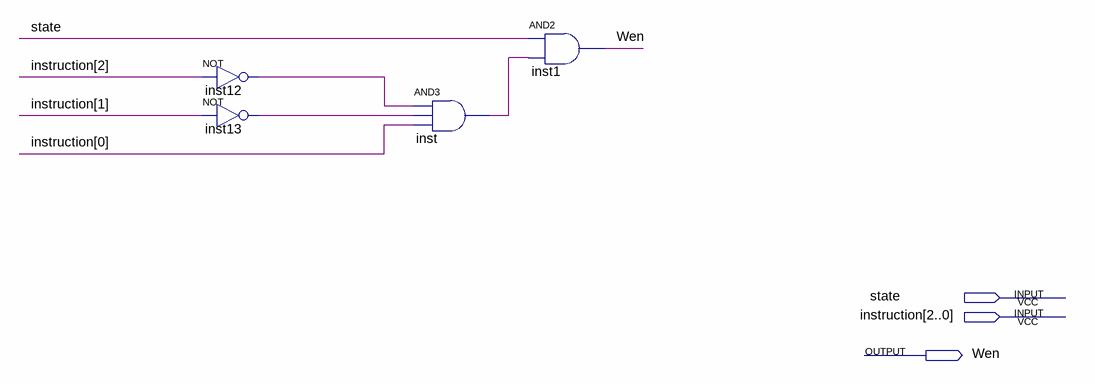
[diagram p0: schematic sheet]
// Quartus schematic controler_write_enable.bdf as structural Verilog: 4 symbols, 3 pins
module controler_write_enable (
  input  state,
  input  [2:0] instruction,
  output Wen
);

  wire inst12_out, inst13_out, inst_out;

  not inst12 (inst12_out, instruction[2]);
  not inst13 (inst13_out, instruction[1]);
  and inst (inst_out, inst12_out, inst13_out, instruction[0]);
  and inst1 (Wen, state, inst_out);
endmodule
